# Altium schematic sheet BalEv_AINa_v1_0.SchDoc
size A3; CompanyName: HESSO; Address1: Route du Rawyl 47; Address2: 1950 Sion; Address3: Switzerland; DocumentNumber: 3; SheetNumber: 6; SheetTotal: 8; PageSetup: Record=PageOptions|CenterHorizontal=True|CenterVertical=True|PrintScale=1.00|XCorrection=1.00|YCorrection=1.00|PrintKind=1|BorderSize=5000000|LeftOffset=0|BottomOffset=0|Orientation=2|PaperLength=1000|PaperWidth=1000|Scale=100|PaperSource=15|PrintQuality=1200|MediaType=1|DitherType=10|PrintScaleMode=1|PaperKind=A4|PaperIndex=9; ProjectName: Project Name
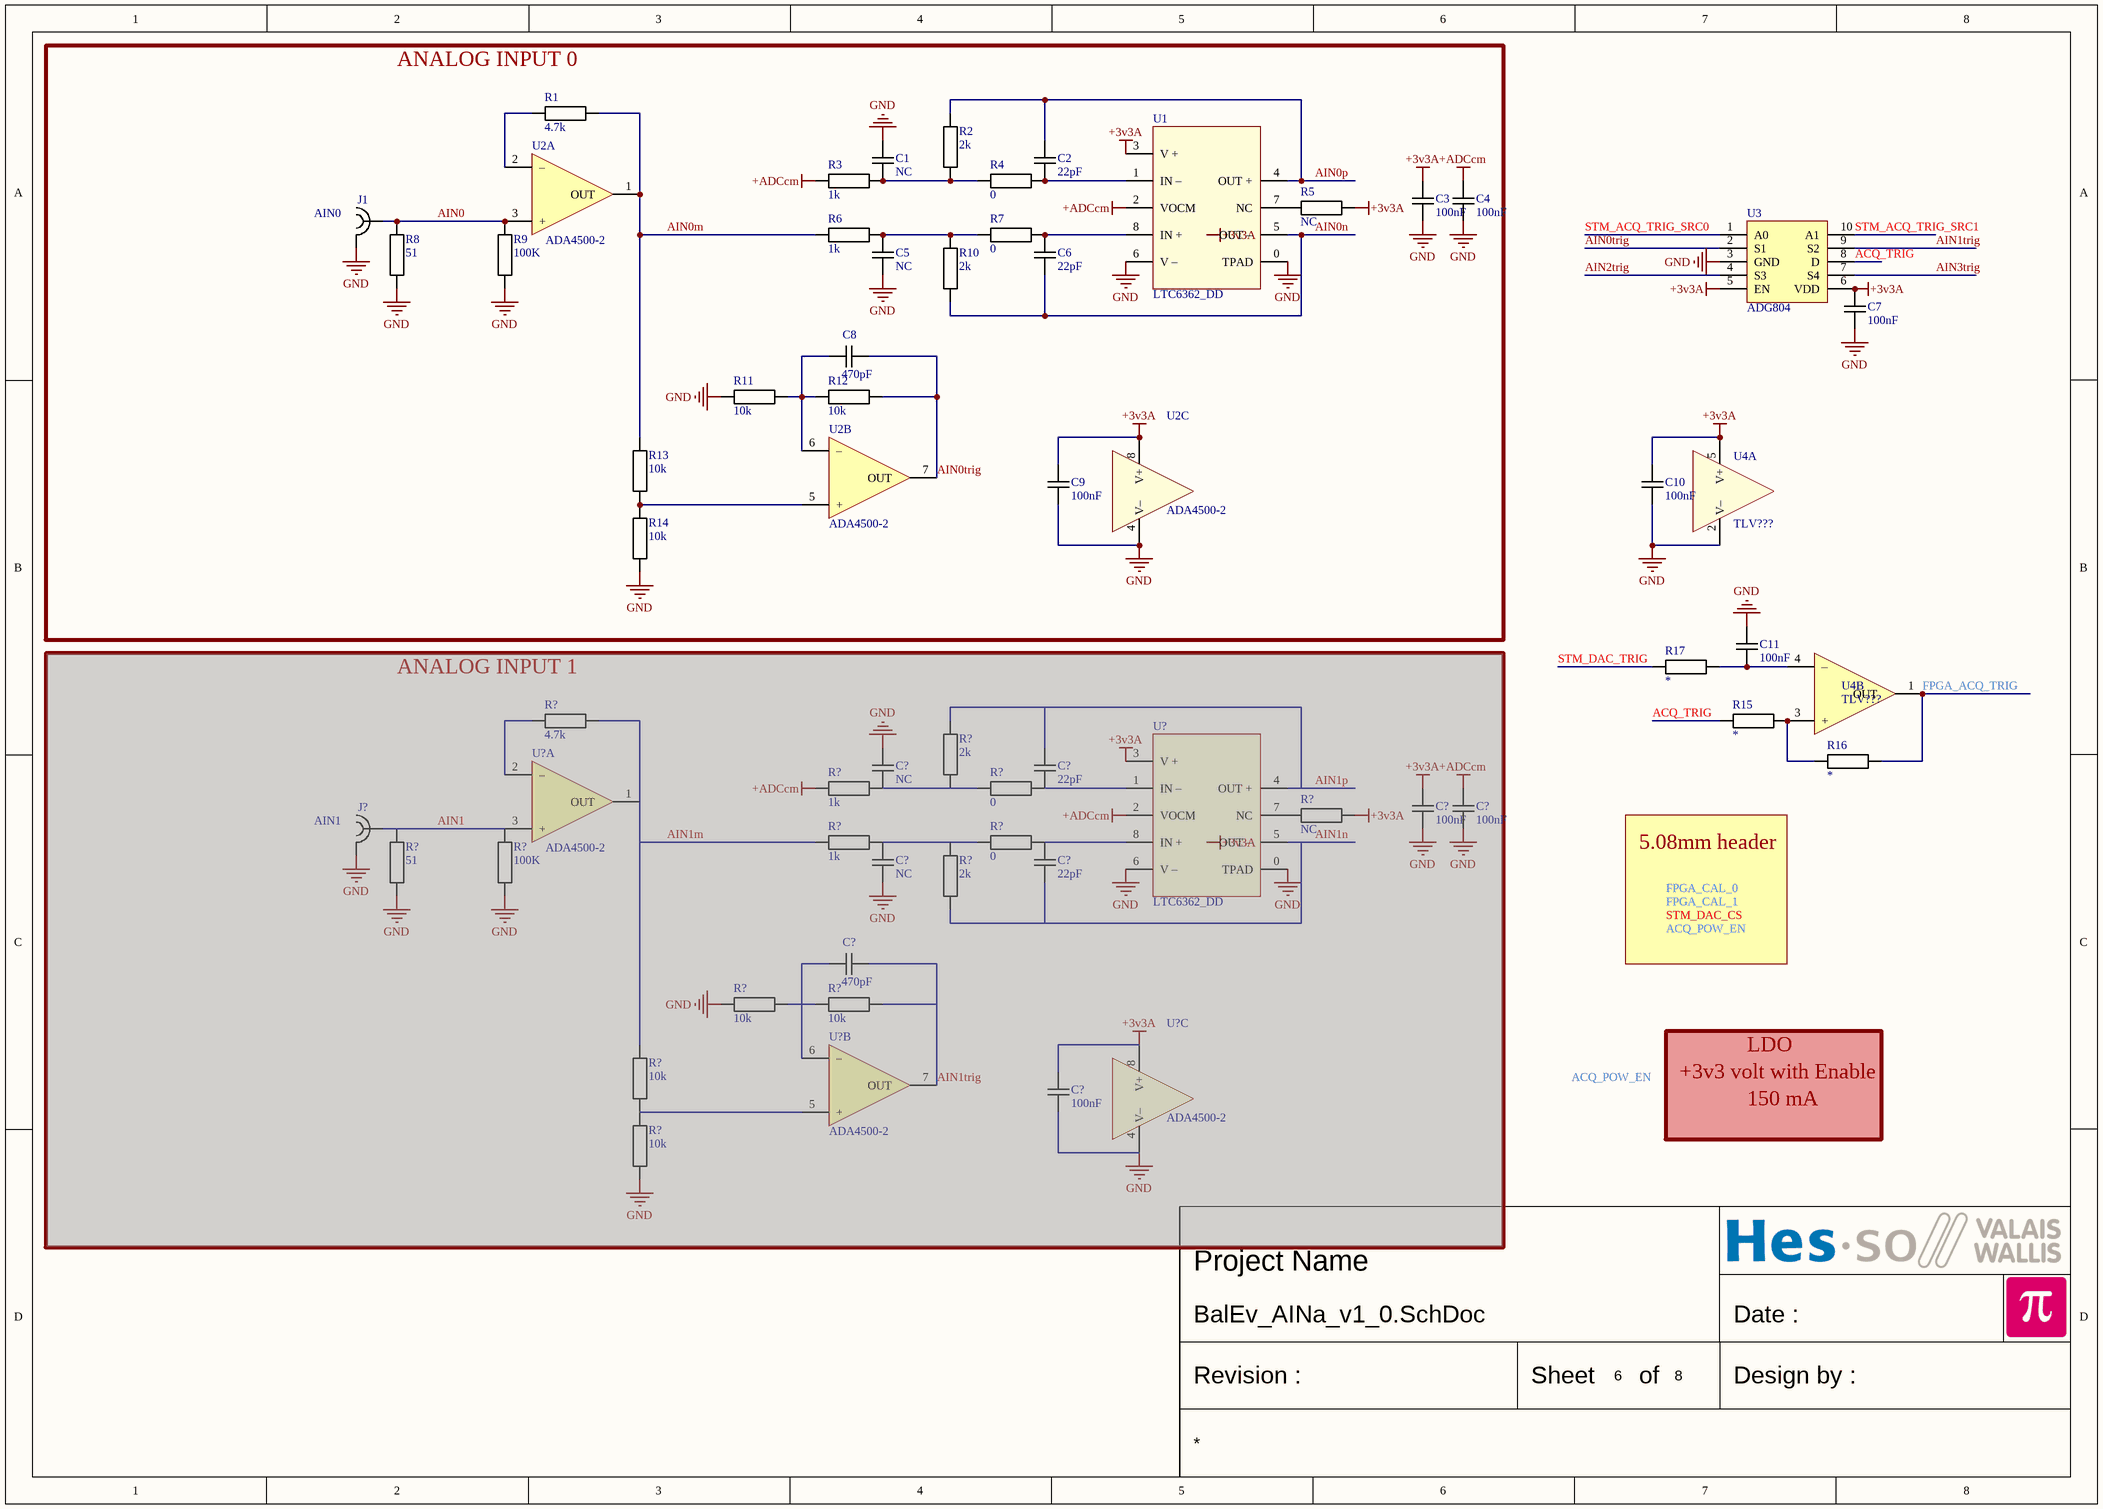
[diagram p0: BalEv_AINa_v1_0.SchDoc]

## Parts
(Parts that share a designator on the sheet are numbered #1, #2 ... from top to bottom, then left to right.)
C1  NC  [CAPACITOR 1005 REFLOW]
C2  22pF  [CAPACITOR 1005 REFLOW]
C3  100nF  [CAPACITOR 1005 REFLOW]
C4  100nF  [CAPACITOR 1005 REFLOW]
C5  NC  [CAPACITOR 1005 REFLOW]
C6  22pF  [CAPACITOR 1005 REFLOW]
C7  100nF  [CAPACITOR 1005 REFLOW]
C8  470pF  [CAPACITOR 1005 REFLOW]
C9  100nF  [CAPACITOR 1005 REFLOW]
C10  100nF  [CAPACITOR 1005 REFLOW]
C11  100nF  [CAPACITOR 1005 REFLOW]
C?#1  NC  [CAPACITOR 1005 REFLOW]  (masked out: inside a compile mask, not in the netlist)
C?#2  22pF  [CAPACITOR 1005 REFLOW]  (masked out: inside a compile mask, not in the netlist)
C?#3  100nF  [CAPACITOR 1005 REFLOW]  (masked out: inside a compile mask, not in the netlist)
C?#4  100nF  [CAPACITOR 1005 REFLOW]  (masked out: inside a compile mask, not in the netlist)
C?#5  NC  [CAPACITOR 1005 REFLOW]  (masked out: inside a compile mask, not in the netlist)
C?#6  22pF  [CAPACITOR 1005 REFLOW]  (masked out: inside a compile mask, not in the netlist)
C?#7  470pF  [CAPACITOR 1005 REFLOW]  (masked out: inside a compile mask, not in the netlist)
C?#8  100nF  [CAPACITOR 1005 REFLOW]  (masked out: inside a compile mask, not in the netlist)
J1  AIN0  [SMA EDGE Molex 732511150]
J?  AIN1  [SMA EDGE Molex 732511150]  (masked out: inside a compile mask, not in the netlist)
R1  4.7k  [RESISTOR 1005 REFLOW]
R2  2k  [RESISTOR 1005 REFLOW]
R3  1k  [RESISTOR 1005 REFLOW]
R4  0  [RESISTOR 1005 REFLOW]
R5  NC  [RESISTOR 1005 REFLOW]
R6  1k  [RESISTOR 1005 REFLOW]
R7  0  [RESISTOR 1005 REFLOW]
R8  51  [RESISTOR 1005 REFLOW]
R9  100K  [RESISTOR 1005 REFLOW]
R10  2k  [RESISTOR 1005 REFLOW]
R11  10k  [RESISTOR 1005 REFLOW]
R12  10k  [RESISTOR 1005 REFLOW]
R13  10k  [RESISTOR 1005 REFLOW]
R14  10k  [RESISTOR 1005 REFLOW]
R15  *  [RESISTOR 1005 REFLOW]
R16  *  [RESISTOR 1005 REFLOW]
R17  *  [RESISTOR 1005 REFLOW]
R?#1  4.7k  [RESISTOR 1005 REFLOW]  (masked out: inside a compile mask, not in the netlist)
R?#2  1k  [RESISTOR 1005 REFLOW]  (masked out: inside a compile mask, not in the netlist)
R?#3  2k  [RESISTOR 1005 REFLOW]  (masked out: inside a compile mask, not in the netlist)
R?#4  0  [RESISTOR 1005 REFLOW]  (masked out: inside a compile mask, not in the netlist)
R?#5  NC  [RESISTOR 1005 REFLOW]  (masked out: inside a compile mask, not in the netlist)
R?#6  1k  [RESISTOR 1005 REFLOW]  (masked out: inside a compile mask, not in the netlist)
R?#7  2k  [RESISTOR 1005 REFLOW]  (masked out: inside a compile mask, not in the netlist)
R?#8  0  [RESISTOR 1005 REFLOW]  (masked out: inside a compile mask, not in the netlist)
R?#9  51  [RESISTOR 1005 REFLOW]  (masked out: inside a compile mask, not in the netlist)
R?#10  100K  [RESISTOR 1005 REFLOW]  (masked out: inside a compile mask, not in the netlist)
R?#11  10k  [RESISTOR 1005 REFLOW]  (masked out: inside a compile mask, not in the netlist)
R?#12  10k  [RESISTOR 1005 REFLOW]  (masked out: inside a compile mask, not in the netlist)
R?#13  10k  [RESISTOR 1005 REFLOW]  (masked out: inside a compile mask, not in the netlist)
R?#14  10k  [RESISTOR 1005 REFLOW]  (masked out: inside a compile mask, not in the netlist)
U1  LTC6362_DD  [LFCSP8 P0.5 C3.0x2.8 H1.0]
U2  ADA4500-2  [MSOP8 P0.65 C3.0X3.0 H1.1]  (parts A,B,C of 3)
U3  ADG804  [TSSOP50P490X110-10N]
U4  TLV???  [SOT23-5 P0.95 C1.6x3.0 H1.3]  (parts A,B of 2)
U?#1  LTC6362_DD  [LFCSP8 P0.5 C3.0x2.8 H1.0]  (masked out: inside a compile mask, not in the netlist)
U?#2  ADA4500-2  [MSOP8 P0.65 C3.0X3.0 H1.1]  (part A of 3)  (masked out: inside a compile mask, not in the netlist)
U?#3  ADA4500-2  [MSOP8 P0.65 C3.0X3.0 H1.1]  (part C of 3)  (masked out: inside a compile mask, not in the netlist)
U?#4  ADA4500-2  [MSOP8 P0.65 C3.0X3.0 H1.1]  (part B of 3)  (masked out: inside a compile mask, not in the netlist)

## Blocks framed on the sheet
ANALOG INPUT 0: C1-C6 C8 C9 J1 R1-R14 U1 U2
ANALOG INPUT 1: C?#1-C?#8 J? R?#1-R?#14 U?#1-U?#4

## Nets
+3v3A: C3.2 C7.1 C9.1 C10.1 R5.2 U1.3(V_+) U2.8(V+) U3.5(EN) U3.6(VDD) U4.5(V+)
+ADCcm: C4.2 R3.1 U1.2(VOCM)
GND: C1.1 C3.1 C4.1 C5.2 C7.2 C9.2 C10.2 C11.1 J1.2 R8.1 R9.1 R11.1 R14.2 U1.0(TPAD) U1.6(V_–) U2.4(V–) U3.3(GND) U4.2(V–)
ACQ_TRIG: R15.2 U3.8(D)
AIN0: J1.1 R8.2 R9.2 U2.3(+)
AIN0m: R1.2 R6.1 R13.1 U2.1(OUT)
AIN0n: C6.1 R10.2 U1.5(OUT_–)
AIN0p: C2.1 R2.2 U1.4(OUT_+)
AIN0trig: C8.1 R12.2 U2.7(OUT) U3.2(S1)
AIN1trig: U3.9(S2)
AIN2trig: U3.4(S3)
AIN3trig: U3.7(S4)
FPGA_ACQ_TRIG: R16.1 U4.1(OUT)
STM_ACQ_TRIG_SRC0: U3.1(A0)
STM_ACQ_TRIG_SRC1: U3.10(A1)
STM_DAC_TRIG: R17.2
NetC1_2: C1.2 R2.1 R3.2 R4.2
NetC2_2: C2.2 R4.1 U1.1(IN_–)
NetC5_1: C5.1 R6.2 R7.1 R10.1
NetC6_2: C6.2 R7.2 U1.8(IN_+)
NetC8_2: C8.2 R11.2 R12.1 U2.6(–)
NetC11_2: C11.2 R17.1 U4.4(–)
NetR1_1: R1.1 U2.2(–)
NetR5_1: R5.1 U1.7(NC)
NetR13_2: R13.2 R14.1 U2.5(+)
NetR15_1: R15.1 R16.2 U4.3(+)

## Notes on the sheet
- 5.08mm header
- LDO
- +3v3 volt with Enable
- 150 mA
- Labels drawn without touching a wire or pin: +3v3A, ACQ_POW_EN, FPGA_CAL_0, FPGA_CAL_1, STM_DAC_CS
- Date :
- Revision :
- Sheet
- of
- Design by :

## Library data of the parts
C1-C11 C?#1-C?#8 = Capacitor
  C1 C5 C?#1 C?#5: Value: NC
  C2 C6 C?#2 C?#6: Value: 22pF
  C3 C4 C7 C9-C11 C?#3 C?#4 C?#8: Value: 100nF
  C8 C?#7: Value: 470pF
J1 J? = SMA EDGE Molex 732511150
  J1: Value: AIN0
  J?: Value: AIN1
R1-R17 R?#1-R?#14 = Resistor
  R1 R?#1: Value: 4.7k
  R2 R10 R?#3 R?#7: Value: 2k
  R3 R6 R?#2 R?#6: Value: 1k
  R4 R7 R?#4 R?#8: Value: 0
  R5 R?#5: Value: NC
  R8 R?#9: Value: 51
  R9 R?#10: Value: 100K
  R11-R14 R?#11-R?#14: Value: 10k
  R15-R17: Value: *
U1 U?#1 = AD8139ACP: IC OPAMP DIFF 410MHZ RRO 8LFCSP; Value: LTC6362_DD
U2 U?#2-U?#4 = OPA DUAL: Generic dual OPA 8 pins; Value: ADA4500-2
U4 = COMPARATOR SINGLE SOT23-5: Generic Single Comparator 5pins 1OUT/2-V/3+IN/4-IN/5+V; Value: TLV???